# Altium schematic sheet SEN_REVC_2.SchDoc: Sensors
size 270 x 223 mm; SheetTotal: 3; Origin: Eagle; Date: 2019-04-04 11:51:56 PM; SheetNumber: 3; GateName_1: G$1; SymbolName_1: LETTER_L; LibraryName: frames; DeviceSetName: LETTER_L; GateName_2: G$2; SymbolName_2: DOCFIELD; Sheet: Sheet:; REV: REV:
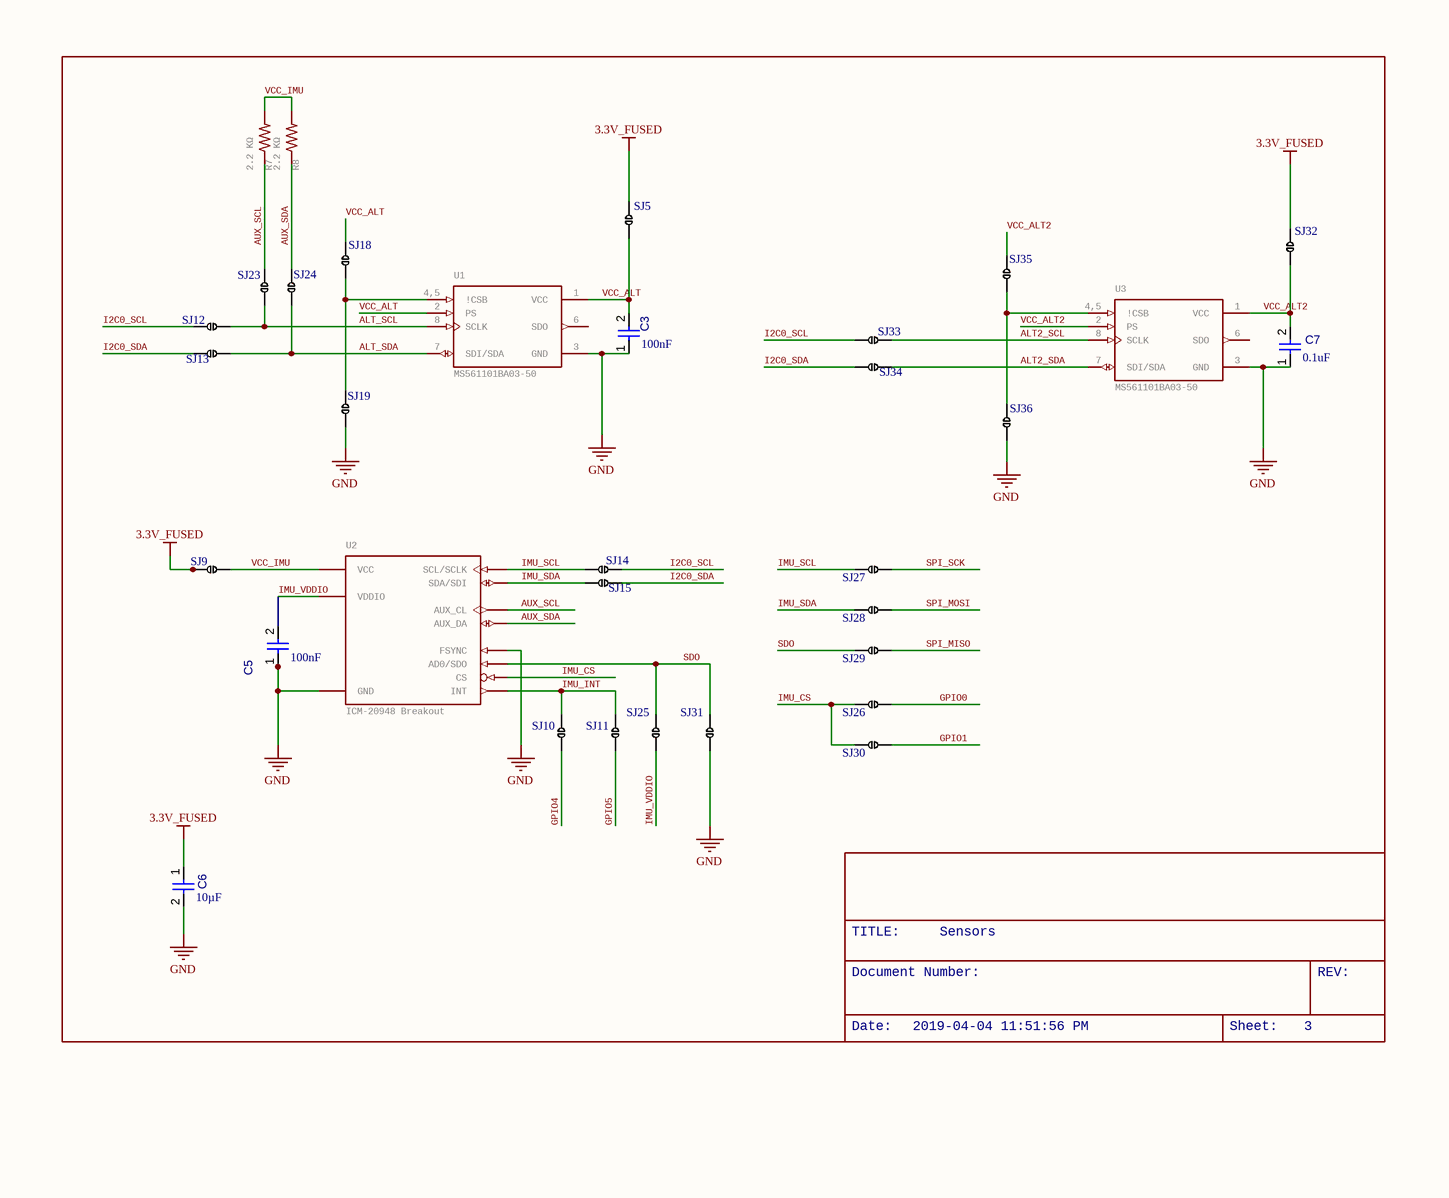
[diagram p0: SEN_REVC_2.SchDoc]

## Parts
C3  value 100nF  [CAPC2013X95X50LL10T25]  (hidden comment: Capacitor 100 nF +/-10% 50 V 0805)
C5  value 100nF  [CAPC2013X95X50LL10T25]  (hidden comment: Capacitor 100 nF +/-10% 50 V 0805)
C6  value 10µF  [CAPC3216X180X50NL20T25]  (hidden comment: Capacitor 10 uF +/- 10% 16 V 1206)
C7  value 0.1uF  [CAPC2013X95X50LL10T25]  (hidden comment: Capacitor 100 nF +/-10% 50 V 0805)
R7  2.2 KΩ  [6-0805_N]
R8  2.2 KΩ  [6-0805_N]
SJ5  Solder Jumper  [Solder Jumper-Footprint-1]  (value not drawn)
SJ9  Solder Jumper  [Solder Jumper-Footprint-1]  (value not drawn)
SJ10  Solder Jumper  [Solder Jumper-Footprint-1]  (value not drawn)
SJ11  Solder Jumper  [Solder Jumper-Footprint-1]  (value not drawn)
SJ12  Solder Jumper  [Solder Jumper-Footprint-1]  (value not drawn)
SJ13  Solder Jumper  [Solder Jumper-Footprint-1]  (value not drawn)
SJ14  Solder Jumper  [Solder Jumper-Footprint-1]  (value not drawn)
SJ15  Solder Jumper  [Solder Jumper-Footprint-1]  (value not drawn)
SJ18  Solder Jumper  [Solder Jumper-Footprint-1]  (value not drawn)
SJ19  Solder Jumper  [Solder Jumper-Footprint-1]  (value not drawn)
SJ23  Solder Jumper  [Solder Jumper-Footprint-1]  (value not drawn)
SJ24  Solder Jumper  [Solder Jumper-Footprint-1]  (value not drawn)
SJ25  Solder Jumper  [Solder Jumper-Footprint-1]  (value not drawn)
SJ26  Solder Jumper  [Solder Jumper-Footprint-1]  (value not drawn)
SJ27  Solder Jumper  [Solder Jumper-Footprint-1]  (value not drawn)
SJ28  Solder Jumper  [Solder Jumper-Footprint-1]  (value not drawn)
SJ29  Solder Jumper  [Solder Jumper-Footprint-1]  (value not drawn)
SJ30  Solder Jumper  [Solder Jumper-Footprint-1]  (value not drawn)
SJ31  Solder Jumper  [Solder Jumper-Footprint-1]  (value not drawn)
SJ32  Solder Jumper  [Solder Jumper-Footprint-1]  (value not drawn)
SJ33  Solder Jumper  [Solder Jumper-Footprint-1]  (value not drawn)
SJ34  Solder Jumper  [Solder Jumper-Footprint-1]  (value not drawn)
SJ35  Solder Jumper  [Solder Jumper-Footprint-1]  (value not drawn)
SJ36  Solder Jumper  [Solder Jumper-Footprint-1]  (value not drawn)
U1  MS561101BA03-50  [MSI-MS561101BA03-50-8_V]
U2  ICM-20948 Breakout  [New footprint 1]
U3  MS561101BA03-50  [MSI-MS561101BA03-50-8_V]

## Nets
3.3V_FUSED: C6.1 SJ5.0 SJ9.0 SJ32.0
GND: C3.1 C5.1 C6.2 C7.1 SJ19.1 SJ31.1 SJ36.1 U1.3(GND) U2.FSYNC U2.GND U3.3(GND)
ALT2_SCL: SJ33.1 U3.8(SCLK)
ALT2_SDA: SJ34.1 U3.7(SDI/SDA)
ALT_SCL: SJ12.1 SJ23.1 U1.8(SCLK)
ALT_SDA: SJ13.1 SJ24.1 U1.7(SDI/SDA)
AUX_SCL: R7.1 SJ23.0 U2.AUX_CL
AUX_SDA: R8.1 SJ24.0 U2.AUX_DA
GPIO0: SJ26.1
GPIO1: SJ30.1
GPIO4: SJ10.1
GPIO5: SJ11.1
I2C0_SCL: SJ12.0 SJ14.1 SJ33.0
I2C0_SDA: SJ13.0 SJ15.1 SJ34.0
IMU_CS: SJ26.0 SJ30.0 U2.NCS(CS)
IMU_INT: SJ10.0 SJ11.0 U2.INT
IMU_SCL: SJ14.0 SJ27.0 U2.SCL/SCLK
IMU_SDA: SJ15.0 SJ28.0 U2.SDA/SDI
IMU_VDDIO: C5.2 SJ25.1 U2.VDDIO
SDO: SJ25.0 SJ29.0 SJ31.0 U2.AD0/SDO
SPI_MISO: SJ29.1
SPI_MOSI: SJ28.1
SPI_SCK: SJ27.1
VCC_ALT: C3.2 SJ5.1 SJ18.0 U1.1(VCC) U1.2(PS)
VCC_ALT2: C7.2 SJ32.1 SJ35.0 U3.1(VCC) U3.2(PS)
VCC_IMU: R7.2 R8.2 SJ9.1 U2.VDD(VCC)
NetSJ18_1: SJ18.1 SJ19.0 U1.4,5(!CSB)
NetSJ35_1: SJ35.1 SJ36.0 U3.4,5(!CSB)

Not connected (* = marked no-connect by the designer): U1 6(SDO); U3 6(SDO)

## Notes on the sheet
- TITLE:
- Sensors
- Document Number:
- REV:
- Date:
- 2019-04-04 11:51:56 PM
- Sheet:
- 3

## Library data of the parts
C3 C5 C7 = CMP-001-00018-6: Chip Capacitor, 100 nF, +/- 10%, 50 V, 0805 (2012 Metric); Capacitor Type: Ceramic; Voltage Rating: 50V; Pins: 2; Max Operating Temperature: 125°C; Min Operating Temperature: -55°C; Mounting Technology: SM; Case/Package: 0805; RoHS Compliant: True; Tolerance: 10%
C6 = CMP-001-00016-6: Chip Capacitor, 10 uF, +/- 10%, 16 V, 1206 (3216 Metric); Capacitor Type: Ceramic; Voltage Rating: 16V; Tolerance: 10%; Min Operating Temperature: -55°C; Pins: 2; Mounting Technology: SM; Case/Package: 1206; Max Operating Temperature: 125°C; RoHS Compliant: True
R7 R8 = R-US_R1206: RESISTOR, American symbol; GateName_1: G$1; SymbolName_1: R-US; DeviceName: R1206; DeviceSetName: R-US_; LibraryName: rcl; SPICEPREFIX: R
SJ5 SJ9-SJ15 SJ18 SJ23-SJ36 = CMP-00020-3: pin to pad: 0>1 1>2
SJ19 = CMP-00020-2
U1 U3 = CMP-002-000017-2: Pressure Sensor 1.44V to 3.6V 0.01bar to 1.2bar Absolute 8-Pin QFN T/R; pin to pad: 4,5>4+5; GateName_1: G$1; MF: TE Connectivity; Min Supply Voltage: 1.8V; Operating Supply Current: 12.5uA; Pressure Type: Barometric; Output Type: Digital; Operating Supply Voltage: 3V; Interface: I2C,SPI; Resolution: 24b; SymbolName_1: MS561101BA03-50; LibraryName: Sensors Board; DeviceSetName: MS561101BA03-50; AVAILABILITY: Unavailable; EU_ROHS_COMPLIANCE: Compliant; MP: MS561101BA03-50; Package: SON125P500X300X100-8N; PRICE: None; TE_PURCHASE_URL: https://www.te.com/usa-en/product-MS561101BA03-50.html?te_bu=Cor&te_type=disp&te_campaign=seda_glo_cor-seda-global-disp-prtnr-fy19-seda-model-bom-cta_sma-317_1&elqCampaignId=32493; Component Type: Standard; Pin Count: 7; Design Item ID: MS561101BA03-50; Source: Sensors Board.SCHLIB; Min Operating Temperature: -40°C; Case/Package: QFN; Max Supply Voltage: 3.6V; Mounting Technology: Surface Mount; Max Operating Temperature: 85°C; Pins: 8; Package Quantity: 3600; Radiation Hardening: No; RoHS Compliant: Yes; Packaging: Tape and Reel; Output Voltage: 3.6V; Nominal Supply Current: 12.5uA; Reach SVHC Compliant: Yes; Supply Current: 12.5uA
U2 = CMP-00021-1: Sparkfun ICM-20948 breakout; pin to pad: AD0/SDO>11 AUX_CL>5 AUX_DA>4 FSYNC>3 GND>1+7 INT>2 NCS>12 SCL/SCLK>10 SDA/SDI>9 VDD>6 VDDIO>8